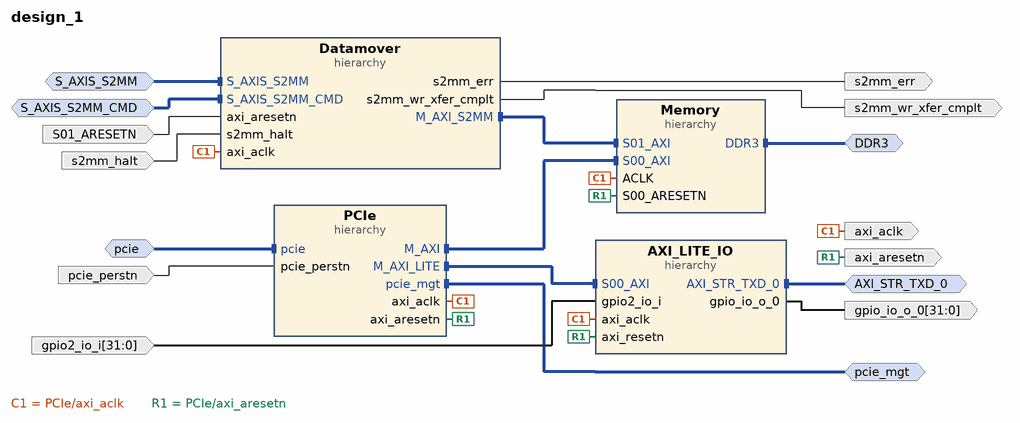
[diagram p0: block diagram of the top level]
# Vivado block design design_1, xc7a200tfbg484-2, Vivado 2020.1
create_bd_design design_1

create_bd_intf_port -mode Slave -vlnv xilinx.com:interface:diff_clock_rtl:1.0 pcie
create_bd_intf_port -mode Master -vlnv xilinx.com:interface:pcie_7x_mgt_rtl:1.0 pcie_mgt
create_bd_intf_port -mode Master -vlnv xilinx.com:interface:ddrx_rtl:1.0 DDR3
create_bd_intf_port -mode Slave -vlnv xilinx.com:interface:axis_rtl:1.0 S_AXIS_S2MM_CMD
set_property -dict [list \
  CONFIG.TDATA_NUM_BYTES 9 \
  CONFIG.TDEST_WIDTH 0 \
  CONFIG.TID_WIDTH 0 \
  CONFIG.TUSER_WIDTH 0 \
  CONFIG.HAS_TREADY 1 \
  CONFIG.HAS_TSTRB 0 \
  CONFIG.HAS_TKEEP 0 \
  CONFIG.HAS_TLAST 0 \
  CONFIG.FREQ_HZ 125000000 \
  CONFIG.LAYERED_METADATA undef \
] [get_bd_intf_ports S_AXIS_S2MM_CMD]
create_bd_intf_port -mode Master -vlnv xilinx.com:interface:axis_rtl:1.0 AXI_STR_TXD_0
set_property -dict {CONFIG.FREQ_HZ 125000000} [get_bd_intf_ports AXI_STR_TXD_0]
create_bd_intf_port -mode Slave -vlnv xilinx.com:interface:axis_rtl:1.0 S_AXIS_S2MM
set_property -dict [list \
  CONFIG.TDATA_NUM_BYTES 16 \
  CONFIG.TDEST_WIDTH 0 \
  CONFIG.TID_WIDTH 0 \
  CONFIG.TUSER_WIDTH 0 \
  CONFIG.HAS_TREADY 1 \
  CONFIG.HAS_TSTRB 0 \
  CONFIG.HAS_TKEEP 1 \
  CONFIG.HAS_TLAST 1 \
  CONFIG.FREQ_HZ 125000000 \
  CONFIG.LAYERED_METADATA undef \
] [get_bd_intf_ports S_AXIS_S2MM]
create_bd_port -dir I -type rst pcie_perstn
create_bd_port -dir O s2mm_err
create_bd_port -dir O s2mm_wr_xfer_cmplt
create_bd_port -dir I -from 31 -to 0 gpio2_io_i
create_bd_port -dir O axi_aresetn
create_bd_port -dir I -type rst S01_ARESETN
create_bd_port -dir I s2mm_halt
create_bd_port -dir O -type clk axi_aclk
create_bd_port -dir O -from 31 -to 0 gpio_io_o_0

create_bd_cell -type hier Memory
create_bd_cell -type hier Datamover
create_bd_cell -type hier AXI_LITE_IO
create_bd_cell -type hier PCIe

# ---- hierarchy /Memory ----
current_bd_instance /Memory
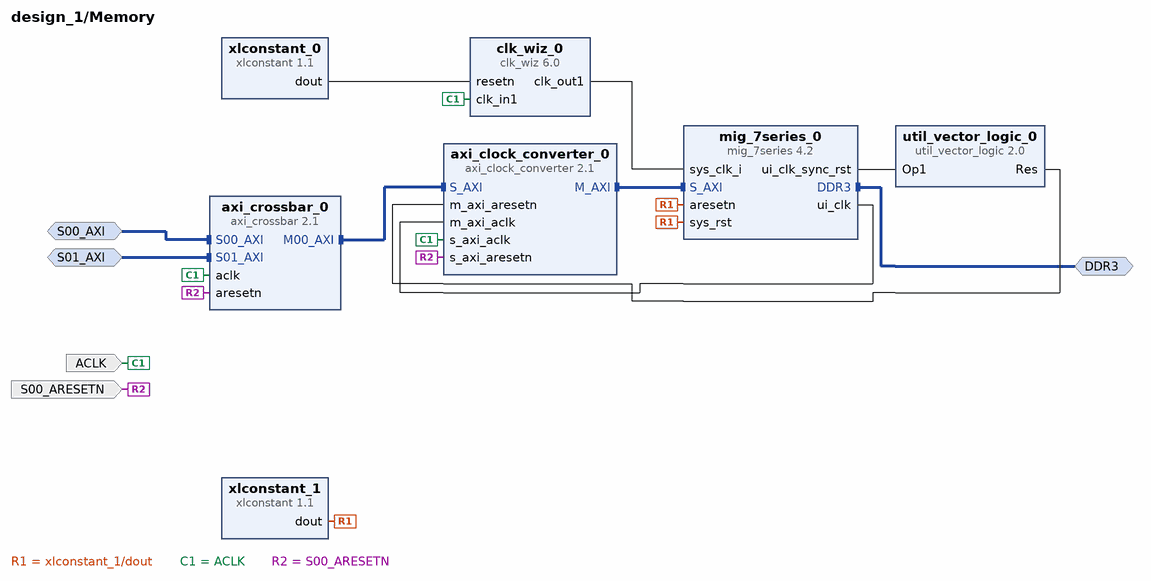
[diagram p1: block diagram inside /Memory]
create_bd_intf_pin -mode Master -vlnv xilinx.com:interface:ddrx_rtl:1.0 DDR3
create_bd_intf_pin -mode Slave -vlnv xilinx.com:interface:aximm_rtl:1.0 S00_AXI
create_bd_intf_pin -mode Slave -vlnv xilinx.com:interface:aximm_rtl:1.0 S01_AXI
create_bd_pin -dir I -type clk ACLK
create_bd_pin -dir I -type rst S00_ARESETN

create_bd_cell -type ip -vlnv xilinx.com:ip:axi_clock_converter:2.1 axi_clock_converter_0
create_bd_cell -type ip -vlnv xilinx.com:ip:axi_crossbar:2.1 axi_crossbar_0
set_property -dict [list \
  CONFIG.ADDR_WIDTH 32 \
  CONFIG.M00_A01_BASE_ADDR 0xffffffffffffffff \
  CONFIG.M00_A02_BASE_ADDR 0xffffffffffffffff \
  CONFIG.M00_A03_BASE_ADDR 0xffffffffffffffff \
  CONFIG.M00_A04_BASE_ADDR 0xffffffffffffffff \
  CONFIG.M00_A05_BASE_ADDR 0xffffffffffffffff \
  CONFIG.M00_A06_BASE_ADDR 0xffffffffffffffff \
  CONFIG.M00_A07_BASE_ADDR 0xffffffffffffffff \
  CONFIG.M00_A08_BASE_ADDR 0xffffffffffffffff \
  CONFIG.M00_A09_BASE_ADDR 0xffffffffffffffff \
  CONFIG.M00_A10_BASE_ADDR 0xffffffffffffffff \
  CONFIG.M00_A11_BASE_ADDR 0xffffffffffffffff \
  CONFIG.M00_A12_BASE_ADDR 0xffffffffffffffff \
  CONFIG.M00_A13_BASE_ADDR 0xffffffffffffffff \
  CONFIG.M00_A14_BASE_ADDR 0xffffffffffffffff \
  CONFIG.M00_A15_BASE_ADDR 0xffffffffffffffff \
  CONFIG.M01_A00_ADDR_WIDTH 0 \
  CONFIG.M01_A00_BASE_ADDR 0xffffffffffffffff \
  CONFIG.M01_A01_BASE_ADDR 0xffffffffffffffff \
  CONFIG.M01_A02_BASE_ADDR 0xffffffffffffffff \
  CONFIG.M01_A03_BASE_ADDR 0xffffffffffffffff \
  CONFIG.M01_A04_BASE_ADDR 0xffffffffffffffff \
  CONFIG.M01_A05_BASE_ADDR 0xffffffffffffffff \
  CONFIG.M01_A06_BASE_ADDR 0xffffffffffffffff \
  CONFIG.M01_A07_BASE_ADDR 0xffffffffffffffff \
  CONFIG.M01_A08_BASE_ADDR 0xffffffffffffffff \
  CONFIG.M01_A09_BASE_ADDR 0xffffffffffffffff \
  CONFIG.M01_A10_BASE_ADDR 0xffffffffffffffff \
  CONFIG.M01_A11_BASE_ADDR 0xffffffffffffffff \
  CONFIG.M01_A12_BASE_ADDR 0xffffffffffffffff \
  CONFIG.M01_A13_BASE_ADDR 0xffffffffffffffff \
  CONFIG.M01_A14_BASE_ADDR 0xffffffffffffffff \
  CONFIG.M01_A15_BASE_ADDR 0xffffffffffffffff \
  CONFIG.M02_A00_ADDR_WIDTH 0 \
  CONFIG.M02_A00_BASE_ADDR 0xffffffffffffffff \
  CONFIG.M02_A01_BASE_ADDR 0xffffffffffffffff \
  CONFIG.M02_A02_BASE_ADDR 0xffffffffffffffff \
  CONFIG.M02_A03_BASE_ADDR 0xffffffffffffffff \
  CONFIG.M02_A04_BASE_ADDR 0xffffffffffffffff \
  CONFIG.M02_A05_BASE_ADDR 0xffffffffffffffff \
  CONFIG.M02_A06_BASE_ADDR 0xffffffffffffffff \
  CONFIG.M02_A07_BASE_ADDR 0xffffffffffffffff \
  CONFIG.M02_A08_BASE_ADDR 0xffffffffffffffff \
  CONFIG.M02_A09_BASE_ADDR 0xffffffffffffffff \
  CONFIG.M02_A10_BASE_ADDR 0xffffffffffffffff \
  CONFIG.M02_A11_BASE_ADDR 0xffffffffffffffff \
  CONFIG.M02_A12_BASE_ADDR 0xffffffffffffffff \
  CONFIG.M02_A13_BASE_ADDR 0xffffffffffffffff \
  CONFIG.M02_A14_BASE_ADDR 0xffffffffffffffff \
  CONFIG.M02_A15_BASE_ADDR 0xffffffffffffffff \
  CONFIG.M03_A00_ADDR_WIDTH 0 \
  CONFIG.M03_A00_BASE_ADDR 0xffffffffffffffff \
  CONFIG.M03_A01_BASE_ADDR 0xffffffffffffffff \
  CONFIG.M03_A02_BASE_ADDR 0xffffffffffffffff \
  CONFIG.M03_A03_BASE_ADDR 0xffffffffffffffff \
  CONFIG.M03_A04_BASE_ADDR 0xffffffffffffffff \
  CONFIG.M03_A05_BASE_ADDR 0xffffffffffffffff \
  CONFIG.M03_A06_BASE_ADDR 0xffffffffffffffff \
  CONFIG.M03_A07_BASE_ADDR 0xffffffffffffffff \
  CONFIG.M03_A08_BASE_ADDR 0xffffffffffffffff \
  CONFIG.M03_A09_BASE_ADDR 0xffffffffffffffff \
  CONFIG.M03_A10_BASE_ADDR 0xffffffffffffffff \
  CONFIG.M03_A11_BASE_ADDR 0xffffffffffffffff \
  CONFIG.M03_A12_BASE_ADDR 0xffffffffffffffff \
  CONFIG.M03_A13_BASE_ADDR 0xffffffffffffffff \
  CONFIG.M03_A14_BASE_ADDR 0xffffffffffffffff \
  CONFIG.M03_A15_BASE_ADDR 0xffffffffffffffff \
  CONFIG.M04_A00_ADDR_WIDTH 0 \
  CONFIG.M04_A00_BASE_ADDR 0xffffffffffffffff \
  CONFIG.M04_A01_BASE_ADDR 0xffffffffffffffff \
  CONFIG.M04_A02_BASE_ADDR 0xffffffffffffffff \
  CONFIG.M04_A03_BASE_ADDR 0xffffffffffffffff \
  CONFIG.M04_A04_BASE_ADDR 0xffffffffffffffff \
  CONFIG.M04_A05_BASE_ADDR 0xffffffffffffffff \
  CONFIG.M04_A06_BASE_ADDR 0xffffffffffffffff \
  CONFIG.M04_A07_BASE_ADDR 0xffffffffffffffff \
  CONFIG.M04_A08_BASE_ADDR 0xffffffffffffffff \
  CONFIG.M04_A09_BASE_ADDR 0xffffffffffffffff \
  CONFIG.M04_A10_BASE_ADDR 0xffffffffffffffff \
  CONFIG.M04_A11_BASE_ADDR 0xffffffffffffffff \
  CONFIG.M04_A12_BASE_ADDR 0xffffffffffffffff \
  CONFIG.M04_A13_BASE_ADDR 0xffffffffffffffff \
  CONFIG.M04_A14_BASE_ADDR 0xffffffffffffffff \
  CONFIG.M04_A15_BASE_ADDR 0xffffffffffffffff \
  CONFIG.M05_A00_ADDR_WIDTH 0 \
  CONFIG.M05_A00_BASE_ADDR 0xffffffffffffffff \
  CONFIG.M05_A01_BASE_ADDR 0xffffffffffffffff \
  CONFIG.M05_A02_BASE_ADDR 0xffffffffffffffff \
  CONFIG.M05_A03_BASE_ADDR 0xffffffffffffffff \
  CONFIG.M05_A04_BASE_ADDR 0xffffffffffffffff \
  CONFIG.M05_A05_BASE_ADDR 0xffffffffffffffff \
  CONFIG.M05_A06_BASE_ADDR 0xffffffffffffffff \
  CONFIG.M05_A07_BASE_ADDR 0xffffffffffffffff \
  CONFIG.M05_A08_BASE_ADDR 0xffffffffffffffff \
  CONFIG.M05_A09_BASE_ADDR 0xffffffffffffffff \
  CONFIG.M05_A10_BASE_ADDR 0xffffffffffffffff \
  CONFIG.M05_A11_BASE_ADDR 0xffffffffffffffff \
  CONFIG.M05_A12_BASE_ADDR 0xffffffffffffffff \
  CONFIG.M05_A13_BASE_ADDR 0xffffffffffffffff \
  CONFIG.M05_A14_BASE_ADDR 0xffffffffffffffff \
  CONFIG.M05_A15_BASE_ADDR 0xffffffffffffffff \
  CONFIG.M06_A00_ADDR_WIDTH 0 \
  CONFIG.M06_A00_BASE_ADDR 0xffffffffffffffff \
  CONFIG.M06_A01_BASE_ADDR 0xffffffffffffffff \
  CONFIG.M06_A02_BASE_ADDR 0xffffffffffffffff \
  CONFIG.M06_A03_BASE_ADDR 0xffffffffffffffff \
  CONFIG.M06_A04_BASE_ADDR 0xffffffffffffffff \
  CONFIG.M06_A05_BASE_ADDR 0xffffffffffffffff \
  CONFIG.M06_A06_BASE_ADDR 0xffffffffffffffff \
  CONFIG.M06_A07_BASE_ADDR 0xffffffffffffffff \
  CONFIG.M06_A08_BASE_ADDR 0xffffffffffffffff \
  CONFIG.M06_A09_BASE_ADDR 0xffffffffffffffff \
  CONFIG.M06_A10_BASE_ADDR 0xffffffffffffffff \
  CONFIG.M06_A11_BASE_ADDR 0xffffffffffffffff \
  CONFIG.M06_A12_BASE_ADDR 0xffffffffffffffff \
  CONFIG.M06_A13_BASE_ADDR 0xffffffffffffffff \
  CONFIG.M06_A14_BASE_ADDR 0xffffffffffffffff \
  CONFIG.M06_A15_BASE_ADDR 0xffffffffffffffff \
  CONFIG.M07_A00_ADDR_WIDTH 0 \
  CONFIG.M07_A00_BASE_ADDR 0xffffffffffffffff \
  CONFIG.M07_A01_BASE_ADDR 0xffffffffffffffff \
  CONFIG.M07_A02_BASE_ADDR 0xffffffffffffffff \
  CONFIG.M07_A03_BASE_ADDR 0xffffffffffffffff \
  CONFIG.M07_A04_BASE_ADDR 0xffffffffffffffff \
  CONFIG.M07_A05_BASE_ADDR 0xffffffffffffffff \
  CONFIG.M07_A06_BASE_ADDR 0xffffffffffffffff \
  CONFIG.M07_A07_BASE_ADDR 0xffffffffffffffff \
  CONFIG.M07_A08_BASE_ADDR 0xffffffffffffffff \
  CONFIG.M07_A09_BASE_ADDR 0xffffffffffffffff \
  CONFIG.M07_A10_BASE_ADDR 0xffffffffffffffff \
  CONFIG.M07_A11_BASE_ADDR 0xffffffffffffffff \
  CONFIG.M07_A12_BASE_ADDR 0xffffffffffffffff \
  CONFIG.M07_A13_BASE_ADDR 0xffffffffffffffff \
  CONFIG.M07_A14_BASE_ADDR 0xffffffffffffffff \
  CONFIG.M07_A15_BASE_ADDR 0xffffffffffffffff \
  CONFIG.M08_A00_ADDR_WIDTH 0 \
  CONFIG.M08_A00_BASE_ADDR 0xffffffffffffffff \
  CONFIG.M08_A01_BASE_ADDR 0xffffffffffffffff \
  CONFIG.M08_A02_BASE_ADDR 0xffffffffffffffff \
  CONFIG.M08_A03_BASE_ADDR 0xffffffffffffffff \
  CONFIG.M08_A04_BASE_ADDR 0xffffffffffffffff \
  CONFIG.M08_A05_BASE_ADDR 0xffffffffffffffff \
  CONFIG.M08_A06_BASE_ADDR 0xffffffffffffffff \
  CONFIG.M08_A07_BASE_ADDR 0xffffffffffffffff \
  CONFIG.M08_A08_BASE_ADDR 0xffffffffffffffff \
  CONFIG.M08_A09_BASE_ADDR 0xffffffffffffffff \
  CONFIG.M08_A10_BASE_ADDR 0xffffffffffffffff \
  CONFIG.M08_A11_BASE_ADDR 0xffffffffffffffff \
  CONFIG.M08_A12_BASE_ADDR 0xffffffffffffffff \
  CONFIG.M08_A13_BASE_ADDR 0xffffffffffffffff \
  CONFIG.M08_A14_BASE_ADDR 0xffffffffffffffff \
  CONFIG.M08_A15_BASE_ADDR 0xffffffffffffffff \
  CONFIG.M09_A00_ADDR_WIDTH 0 \
  CONFIG.M09_A00_BASE_ADDR 0xffffffffffffffff \
  CONFIG.M09_A01_BASE_ADDR 0xffffffffffffffff \
  CONFIG.M09_A02_BASE_ADDR 0xffffffffffffffff \
  CONFIG.M09_A03_BASE_ADDR 0xffffffffffffffff \
  CONFIG.M09_A04_BASE_ADDR 0xffffffffffffffff \
  CONFIG.M09_A05_BASE_ADDR 0xffffffffffffffff \
  CONFIG.M09_A06_BASE_ADDR 0xffffffffffffffff \
  CONFIG.M09_A07_BASE_ADDR 0xffffffffffffffff \
  CONFIG.M09_A08_BASE_ADDR 0xffffffffffffffff \
  CONFIG.M09_A09_BASE_ADDR 0xffffffffffffffff \
  CONFIG.M09_A10_BASE_ADDR 0xffffffffffffffff \
  CONFIG.M09_A11_BASE_ADDR 0xffffffffffffffff \
  CONFIG.M09_A12_BASE_ADDR 0xffffffffffffffff \
  CONFIG.M09_A13_BASE_ADDR 0xffffffffffffffff \
  CONFIG.M09_A14_BASE_ADDR 0xffffffffffffffff \
  CONFIG.M09_A15_BASE_ADDR 0xffffffffffffffff \
  CONFIG.M10_A00_ADDR_WIDTH 0 \
  CONFIG.M10_A00_BASE_ADDR 0xffffffffffffffff \
  CONFIG.M10_A01_BASE_ADDR 0xffffffffffffffff \
  CONFIG.M10_A02_BASE_ADDR 0xffffffffffffffff \
  CONFIG.M10_A03_BASE_ADDR 0xffffffffffffffff \
  CONFIG.M10_A04_BASE_ADDR 0xffffffffffffffff \
  CONFIG.M10_A05_BASE_ADDR 0xffffffffffffffff \
  CONFIG.M10_A06_BASE_ADDR 0xffffffffffffffff \
  CONFIG.M10_A07_BASE_ADDR 0xffffffffffffffff \
  CONFIG.M10_A08_BASE_ADDR 0xffffffffffffffff \
  CONFIG.M10_A09_BASE_ADDR 0xffffffffffffffff \
  CONFIG.M10_A10_BASE_ADDR 0xffffffffffffffff \
  CONFIG.M10_A11_BASE_ADDR 0xffffffffffffffff \
  CONFIG.M10_A12_BASE_ADDR 0xffffffffffffffff \
  CONFIG.M10_A13_BASE_ADDR 0xffffffffffffffff \
  CONFIG.M10_A14_BASE_ADDR 0xffffffffffffffff \
  CONFIG.M10_A15_BASE_ADDR 0xffffffffffffffff \
  CONFIG.M11_A00_ADDR_WIDTH 0 \
  CONFIG.M11_A00_BASE_ADDR 0xffffffffffffffff \
  CONFIG.M11_A01_BASE_ADDR 0xffffffffffffffff \
  CONFIG.M11_A02_BASE_ADDR 0xffffffffffffffff \
  CONFIG.M11_A03_BASE_ADDR 0xffffffffffffffff \
  CONFIG.M11_A04_BASE_ADDR 0xffffffffffffffff \
  CONFIG.M11_A05_BASE_ADDR 0xffffffffffffffff \
  CONFIG.M11_A06_BASE_ADDR 0xffffffffffffffff \
  CONFIG.M11_A07_BASE_ADDR 0xffffffffffffffff \
  CONFIG.M11_A08_BASE_ADDR 0xffffffffffffffff \
  CONFIG.M11_A09_BASE_ADDR 0xffffffffffffffff \
  CONFIG.M11_A10_BASE_ADDR 0xffffffffffffffff \
  CONFIG.M11_A11_BASE_ADDR 0xffffffffffffffff \
  CONFIG.M11_A12_BASE_ADDR 0xffffffffffffffff \
  CONFIG.M11_A13_BASE_ADDR 0xffffffffffffffff \
  CONFIG.M11_A14_BASE_ADDR 0xffffffffffffffff \
  CONFIG.M11_A15_BASE_ADDR 0xffffffffffffffff \
  CONFIG.M12_A00_ADDR_WIDTH 0 \
  CONFIG.M12_A00_BASE_ADDR 0xffffffffffffffff \
  CONFIG.M12_A01_BASE_ADDR 0xffffffffffffffff \
  CONFIG.M12_A02_BASE_ADDR 0xffffffffffffffff \
  CONFIG.M12_A03_BASE_ADDR 0xffffffffffffffff \
  CONFIG.M12_A04_BASE_ADDR 0xffffffffffffffff \
  CONFIG.M12_A05_BASE_ADDR 0xffffffffffffffff \
  CONFIG.M12_A06_BASE_ADDR 0xffffffffffffffff \
  CONFIG.M12_A07_BASE_ADDR 0xffffffffffffffff \
  CONFIG.M12_A08_BASE_ADDR 0xffffffffffffffff \
  CONFIG.M12_A09_BASE_ADDR 0xffffffffffffffff \
  CONFIG.M12_A10_BASE_ADDR 0xffffffffffffffff \
  CONFIG.M12_A11_BASE_ADDR 0xffffffffffffffff \
  CONFIG.M12_A12_BASE_ADDR 0xffffffffffffffff \
  CONFIG.M12_A13_BASE_ADDR 0xffffffffffffffff \
  CONFIG.M12_A14_BASE_ADDR 0xffffffffffffffff \
  CONFIG.M12_A15_BASE_ADDR 0xffffffffffffffff \
  CONFIG.M13_A00_ADDR_WIDTH 0 \
  CONFIG.M13_A00_BASE_ADDR 0xffffffffffffffff \
  CONFIG.M13_A01_BASE_ADDR 0xffffffffffffffff \
  CONFIG.M13_A02_BASE_ADDR 0xffffffffffffffff \
  CONFIG.M13_A03_BASE_ADDR 0xffffffffffffffff \
  CONFIG.M13_A04_BASE_ADDR 0xffffffffffffffff \
  CONFIG.M13_A05_BASE_ADDR 0xffffffffffffffff \
  CONFIG.M13_A06_BASE_ADDR 0xffffffffffffffff \
  CONFIG.M13_A07_BASE_ADDR 0xffffffffffffffff \
  CONFIG.M13_A08_BASE_ADDR 0xffffffffffffffff \
  CONFIG.M13_A09_BASE_ADDR 0xffffffffffffffff \
  CONFIG.M13_A10_BASE_ADDR 0xffffffffffffffff \
  CONFIG.M13_A11_BASE_ADDR 0xffffffffffffffff \
  CONFIG.M13_A12_BASE_ADDR 0xffffffffffffffff \
  CONFIG.M13_A13_BASE_ADDR 0xffffffffffffffff \
  CONFIG.M13_A14_BASE_ADDR 0xffffffffffffffff \
  CONFIG.M13_A15_BASE_ADDR 0xffffffffffffffff \
  CONFIG.M14_A00_ADDR_WIDTH 0 \
  CONFIG.M14_A00_BASE_ADDR 0xffffffffffffffff \
  CONFIG.M14_A01_BASE_ADDR 0xffffffffffffffff \
  CONFIG.M14_A02_BASE_ADDR 0xffffffffffffffff \
  CONFIG.M14_A03_BASE_ADDR 0xffffffffffffffff \
  CONFIG.M14_A04_BASE_ADDR 0xffffffffffffffff \
  CONFIG.M14_A05_BASE_ADDR 0xffffffffffffffff \
  CONFIG.M14_A06_BASE_ADDR 0xffffffffffffffff \
  CONFIG.M14_A07_BASE_ADDR 0xffffffffffffffff \
  CONFIG.M14_A08_BASE_ADDR 0xffffffffffffffff \
  CONFIG.M14_A09_BASE_ADDR 0xffffffffffffffff \
  CONFIG.M14_A10_BASE_ADDR 0xffffffffffffffff \
  CONFIG.M14_A11_BASE_ADDR 0xffffffffffffffff \
  CONFIG.M14_A12_BASE_ADDR 0xffffffffffffffff \
  CONFIG.M14_A13_BASE_ADDR 0xffffffffffffffff \
  CONFIG.M14_A14_BASE_ADDR 0xffffffffffffffff \
  CONFIG.M14_A15_BASE_ADDR 0xffffffffffffffff \
  CONFIG.M15_A00_ADDR_WIDTH 0 \
  CONFIG.M15_A00_BASE_ADDR 0xffffffffffffffff \
  CONFIG.M15_A01_BASE_ADDR 0xffffffffffffffff \
  CONFIG.M15_A02_BASE_ADDR 0xffffffffffffffff \
  CONFIG.M15_A03_BASE_ADDR 0xffffffffffffffff \
  CONFIG.M15_A04_BASE_ADDR 0xffffffffffffffff \
  CONFIG.M15_A05_BASE_ADDR 0xffffffffffffffff \
  CONFIG.M15_A06_BASE_ADDR 0xffffffffffffffff \
  CONFIG.M15_A07_BASE_ADDR 0xffffffffffffffff \
  CONFIG.M15_A08_BASE_ADDR 0xffffffffffffffff \
  CONFIG.M15_A09_BASE_ADDR 0xffffffffffffffff \
  CONFIG.M15_A10_BASE_ADDR 0xffffffffffffffff \
  CONFIG.M15_A11_BASE_ADDR 0xffffffffffffffff \
  CONFIG.M15_A12_BASE_ADDR 0xffffffffffffffff \
  CONFIG.M15_A13_BASE_ADDR 0xffffffffffffffff \
  CONFIG.M15_A14_BASE_ADDR 0xffffffffffffffff \
  CONFIG.M15_A15_BASE_ADDR 0xffffffffffffffff \
  CONFIG.NUM_MI 1 \
  CONFIG.NUM_SI 2 \
] [get_bd_cells axi_crossbar_0]
create_bd_cell -type ip -vlnv xilinx.com:ip:clk_wiz:6.0 clk_wiz_0
set_property -dict [list \
  CONFIG.CLKIN1_JITTER_PS 80.0 \
  CONFIG.CLKIN2_JITTER_PS 100.0 \
  CONFIG.CLKOUT1_DRIVES BUFG \
  CONFIG.CLKOUT1_JITTER 109.241 \
  CONFIG.CLKOUT1_PHASE_ERROR 96.948 \
  CONFIG.CLKOUT1_REQUESTED_OUT_FREQ 200 \
  CONFIG.CLKOUT2_DRIVES BUFG \
  CONFIG.CLKOUT3_DRIVES BUFG \
  CONFIG.CLKOUT4_DRIVES BUFG \
  CONFIG.CLKOUT5_DRIVES BUFG \
  CONFIG.CLKOUT6_DRIVES BUFG \
  CONFIG.CLKOUT7_DRIVES BUFG \
  CONFIG.MMCM_BANDWIDTH OPTIMIZED \
  CONFIG.MMCM_CLKFBOUT_MULT_F 8 \
  CONFIG.MMCM_CLKIN1_PERIOD 8.000 \
  CONFIG.MMCM_CLKIN2_PERIOD 10.0 \
  CONFIG.MMCM_CLKOUT0_DIVIDE_F 5 \
  CONFIG.MMCM_COMPENSATION ZHOLD \
  CONFIG.PLL_CLKIN_PERIOD 8.000 \
  CONFIG.PRIMITIVE PLL \
  CONFIG.PRIM_IN_FREQ 125.000 \
  CONFIG.PRIM_SOURCE No_buffer \
  CONFIG.RESET_PORT resetn \
  CONFIG.RESET_TYPE ACTIVE_LOW \
  CONFIG.SECONDARY_SOURCE Single_ended_clock_capable_pin \
  CONFIG.USE_INCLK_SWITCHOVER false \
] [get_bd_cells clk_wiz_0]
create_bd_cell -type ip -vlnv xilinx.com:ip:mig_7series:4.2 mig_7series_0
set_property -dict [list \
  CONFIG.BOARD_MIG_PARAM Custom \
  CONFIG.MIG_DONT_TOUCH_PARAM Custom \
  CONFIG.RESET_BOARD_INTERFACE Custom \
  CONFIG.XML_INPUT_FILE mig_b.prj \
] [get_bd_cells mig_7series_0]
create_bd_cell -type ip -vlnv xilinx.com:ip:util_vector_logic:2.0 util_vector_logic_0
set_property -dict {CONFIG.C_OPERATION not CONFIG.C_SIZE 1} [get_bd_cells util_vector_logic_0]
create_bd_cell -type ip -vlnv xilinx.com:ip:xlconstant:1.1 xlconstant_0
create_bd_cell -type ip -vlnv xilinx.com:ip:xlconstant:1.1 xlconstant_1

# ---- hierarchy /Datamover ----
current_bd_instance /Datamover
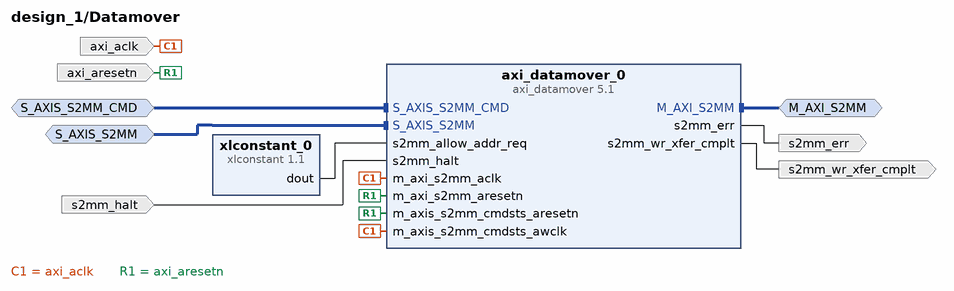
[diagram p2: block diagram inside /Datamover]
create_bd_intf_pin -mode Slave -vlnv xilinx.com:interface:axis_rtl:1.0 S_AXIS_S2MM_CMD
create_bd_intf_pin -mode Master -vlnv xilinx.com:interface:aximm_rtl:1.0 M_AXI_S2MM
create_bd_intf_pin -mode Slave -vlnv xilinx.com:interface:axis_rtl:1.0 S_AXIS_S2MM
create_bd_pin -dir I -type clk axi_aclk
create_bd_pin -dir I -type rst axi_aresetn
create_bd_pin -dir O s2mm_err
create_bd_pin -dir O s2mm_wr_xfer_cmplt
create_bd_pin -dir I s2mm_halt

create_bd_cell -type ip -vlnv xilinx.com:ip:axi_datamover:5.1 axi_datamover_0
set_property -dict [list \
  CONFIG.c_dummy 1 \
  CONFIG.c_enable_mm2s 0 \
  CONFIG.c_enable_s2mm_adv_sig 1 \
  CONFIG.c_m_axi_s2mm_data_width 256 \
  CONFIG.c_m_axi_s2mm_id_width 0 \
  CONFIG.c_s2mm_burst_size 128 \
  CONFIG.c_s_axis_s2mm_tdata_width 128 \
] [get_bd_cells axi_datamover_0]
create_bd_cell -type ip -vlnv xilinx.com:ip:xlconstant:1.1 xlconstant_0

# ---- hierarchy /AXI_LITE_IO ----
current_bd_instance /AXI_LITE_IO
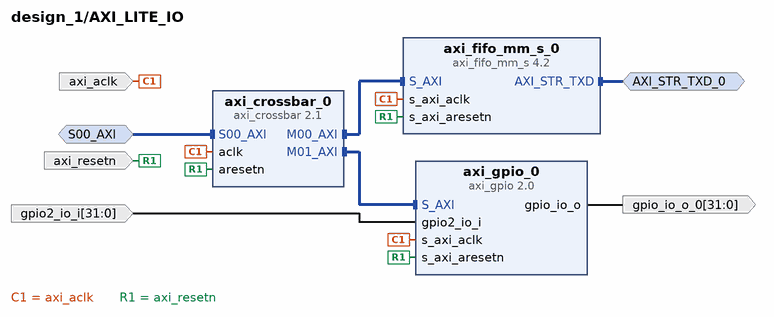
[diagram p3: block diagram inside /AXI_LITE_IO]
create_bd_intf_pin -mode Slave -vlnv xilinx.com:interface:aximm_rtl:1.0 S00_AXI
create_bd_intf_pin -mode Master -vlnv xilinx.com:interface:axis_rtl:1.0 AXI_STR_TXD_0
create_bd_pin -dir I -from 31 -to 0 gpio2_io_i
create_bd_pin -dir I -type clk axi_aclk
create_bd_pin -dir I -type rst axi_resetn
create_bd_pin -dir O -from 31 -to 0 gpio_io_o_0

create_bd_cell -type ip -vlnv xilinx.com:ip:axi_crossbar:2.1 axi_crossbar_0
set_property -dict [list \
  CONFIG.M00_A01_BASE_ADDR 0xffffffffffffffff \
  CONFIG.M00_A02_BASE_ADDR 0xffffffffffffffff \
  CONFIG.M00_A03_BASE_ADDR 0xffffffffffffffff \
  CONFIG.M00_A04_BASE_ADDR 0xffffffffffffffff \
  CONFIG.M00_A05_BASE_ADDR 0xffffffffffffffff \
  CONFIG.M00_A06_BASE_ADDR 0xffffffffffffffff \
  CONFIG.M00_A07_BASE_ADDR 0xffffffffffffffff \
  CONFIG.M00_A08_BASE_ADDR 0xffffffffffffffff \
  CONFIG.M00_A09_BASE_ADDR 0xffffffffffffffff \
  CONFIG.M00_A10_BASE_ADDR 0xffffffffffffffff \
  CONFIG.M00_A11_BASE_ADDR 0xffffffffffffffff \
  CONFIG.M00_A12_BASE_ADDR 0xffffffffffffffff \
  CONFIG.M00_A13_BASE_ADDR 0xffffffffffffffff \
  CONFIG.M00_A14_BASE_ADDR 0xffffffffffffffff \
  CONFIG.M00_A15_BASE_ADDR 0xffffffffffffffff \
  CONFIG.M01_A01_BASE_ADDR 0xffffffffffffffff \
  CONFIG.M01_A02_BASE_ADDR 0xffffffffffffffff \
  CONFIG.M01_A03_BASE_ADDR 0xffffffffffffffff \
  CONFIG.M01_A04_BASE_ADDR 0xffffffffffffffff \
  CONFIG.M01_A05_BASE_ADDR 0xffffffffffffffff \
  CONFIG.M01_A06_BASE_ADDR 0xffffffffffffffff \
  CONFIG.M01_A07_BASE_ADDR 0xffffffffffffffff \
  CONFIG.M01_A08_BASE_ADDR 0xffffffffffffffff \
  CONFIG.M01_A09_BASE_ADDR 0xffffffffffffffff \
  CONFIG.M01_A10_BASE_ADDR 0xffffffffffffffff \
  CONFIG.M01_A11_BASE_ADDR 0xffffffffffffffff \
  CONFIG.M01_A12_BASE_ADDR 0xffffffffffffffff \
  CONFIG.M01_A13_BASE_ADDR 0xffffffffffffffff \
  CONFIG.M01_A14_BASE_ADDR 0xffffffffffffffff \
  CONFIG.M01_A15_BASE_ADDR 0xffffffffffffffff \
  CONFIG.M02_A00_ADDR_WIDTH 0 \
  CONFIG.M02_A00_BASE_ADDR 0xffffffffffffffff \
  CONFIG.M02_A01_BASE_ADDR 0xffffffffffffffff \
  CONFIG.M02_A02_BASE_ADDR 0xffffffffffffffff \
  CONFIG.M02_A03_BASE_ADDR 0xffffffffffffffff \
  CONFIG.M02_A04_BASE_ADDR 0xffffffffffffffff \
  CONFIG.M02_A05_BASE_ADDR 0xffffffffffffffff \
  CONFIG.M02_A06_BASE_ADDR 0xffffffffffffffff \
  CONFIG.M02_A07_BASE_ADDR 0xffffffffffffffff \
  CONFIG.M02_A08_BASE_ADDR 0xffffffffffffffff \
  CONFIG.M02_A09_BASE_ADDR 0xffffffffffffffff \
  CONFIG.M02_A10_BASE_ADDR 0xffffffffffffffff \
  CONFIG.M02_A11_BASE_ADDR 0xffffffffffffffff \
  CONFIG.M02_A12_BASE_ADDR 0xffffffffffffffff \
  CONFIG.M02_A13_BASE_ADDR 0xffffffffffffffff \
  CONFIG.M02_A14_BASE_ADDR 0xffffffffffffffff \
  CONFIG.M02_A15_BASE_ADDR 0xffffffffffffffff \
  CONFIG.M02_READ_ISSUING 1 \
  CONFIG.M02_WRITE_ISSUING 1 \
  CONFIG.M03_A00_ADDR_WIDTH 0 \
  CONFIG.M03_A00_BASE_ADDR 0xffffffffffffffff \
  CONFIG.M03_A01_BASE_ADDR 0xffffffffffffffff \
  CONFIG.M03_A02_BASE_ADDR 0xffffffffffffffff \
  CONFIG.M03_A03_BASE_ADDR 0xffffffffffffffff \
  CONFIG.M03_A04_BASE_ADDR 0xffffffffffffffff \
  CONFIG.M03_A05_BASE_ADDR 0xffffffffffffffff \
  CONFIG.M03_A06_BASE_ADDR 0xffffffffffffffff \
  CONFIG.M03_A07_BASE_ADDR 0xffffffffffffffff \
  CONFIG.M03_A08_BASE_ADDR 0xffffffffffffffff \
  CONFIG.M03_A09_BASE_ADDR 0xffffffffffffffff \
  CONFIG.M03_A10_BASE_ADDR 0xffffffffffffffff \
  CONFIG.M03_A11_BASE_ADDR 0xffffffffffffffff \
  CONFIG.M03_A12_BASE_ADDR 0xffffffffffffffff \
  CONFIG.M03_A13_BASE_ADDR 0xffffffffffffffff \
  CONFIG.M03_A14_BASE_ADDR 0xffffffffffffffff \
  CONFIG.M03_A15_BASE_ADDR 0xffffffffffffffff \
  CONFIG.M03_READ_ISSUING 1 \
  CONFIG.M03_WRITE_ISSUING 1 \
  CONFIG.M04_A00_ADDR_WIDTH 0 \
  CONFIG.M04_A00_BASE_ADDR 0xffffffffffffffff \
  CONFIG.M04_A01_BASE_ADDR 0xffffffffffffffff \
  CONFIG.M04_A02_BASE_ADDR 0xffffffffffffffff \
  CONFIG.M04_A03_BASE_ADDR 0xffffffffffffffff \
  CONFIG.M04_A04_BASE_ADDR 0xffffffffffffffff \
  CONFIG.M04_A05_BASE_ADDR 0xffffffffffffffff \
  CONFIG.M04_A06_BASE_ADDR 0xffffffffffffffff \
  CONFIG.M04_A07_BASE_ADDR 0xffffffffffffffff \
  CONFIG.M04_A08_BASE_ADDR 0xffffffffffffffff \
  CONFIG.M04_A09_BASE_ADDR 0xffffffffffffffff \
  CONFIG.M04_A10_BASE_ADDR 0xffffffffffffffff \
  CONFIG.M04_A11_BASE_ADDR 0xffffffffffffffff \
  CONFIG.M04_A12_BASE_ADDR 0xffffffffffffffff \
  CONFIG.M04_A13_BASE_ADDR 0xffffffffffffffff \
  CONFIG.M04_A14_BASE_ADDR 0xffffffffffffffff \
  CONFIG.M04_A15_BASE_ADDR 0xffffffffffffffff \
  CONFIG.M04_READ_ISSUING 1 \
  CONFIG.M04_WRITE_ISSUING 1 \
  CONFIG.M05_A00_ADDR_WIDTH 0 \
  CONFIG.M05_A00_BASE_ADDR 0xffffffffffffffff \
  CONFIG.M05_A01_BASE_ADDR 0xffffffffffffffff \
  CONFIG.M05_A02_BASE_ADDR 0xffffffffffffffff \
  CONFIG.M05_A03_BASE_ADDR 0xffffffffffffffff \
  CONFIG.M05_A04_BASE_ADDR 0xffffffffffffffff \
  CONFIG.M05_A05_BASE_ADDR 0xffffffffffffffff \
  CONFIG.M05_A06_BASE_ADDR 0xffffffffffffffff \
  CONFIG.M05_A07_BASE_ADDR 0xffffffffffffffff \
  CONFIG.M05_A08_BASE_ADDR 0xffffffffffffffff \
  CONFIG.M05_A09_BASE_ADDR 0xffffffffffffffff \
  CONFIG.M05_A10_BASE_ADDR 0xffffffffffffffff \
  CONFIG.M05_A11_BASE_ADDR 0xffffffffffffffff \
  CONFIG.M05_A12_BASE_ADDR 0xffffffffffffffff \
  CONFIG.M05_A13_BASE_ADDR 0xffffffffffffffff \
  CONFIG.M05_A14_BASE_ADDR 0xffffffffffffffff \
  CONFIG.M05_A15_BASE_ADDR 0xffffffffffffffff \
  CONFIG.M05_READ_ISSUING 1 \
  CONFIG.M05_WRITE_ISSUING 1 \
  CONFIG.M06_A00_ADDR_WIDTH 0 \
  CONFIG.M06_A00_BASE_ADDR 0xffffffffffffffff \
  CONFIG.M06_A01_BASE_ADDR 0xffffffffffffffff \
  CONFIG.M06_A02_BASE_ADDR 0xffffffffffffffff \
  CONFIG.M06_A03_BASE_ADDR 0xffffffffffffffff \
  CONFIG.M06_A04_BASE_ADDR 0xffffffffffffffff \
  CONFIG.M06_A05_BASE_ADDR 0xffffffffffffffff \
  CONFIG.M06_A06_BASE_ADDR 0xffffffffffffffff \
  CONFIG.M06_A07_BASE_ADDR 0xffffffffffffffff \
  CONFIG.M06_A08_BASE_ADDR 0xffffffffffffffff \
  CONFIG.M06_A09_BASE_ADDR 0xffffffffffffffff \
  CONFIG.M06_A10_BASE_ADDR 0xffffffffffffffff \
  CONFIG.M06_A11_BASE_ADDR 0xffffffffffffffff \
  CONFIG.M06_A12_BASE_ADDR 0xffffffffffffffff \
  CONFIG.M06_A13_BASE_ADDR 0xffffffffffffffff \
  CONFIG.M06_A14_BASE_ADDR 0xffffffffffffffff \
  CONFIG.M06_A15_BASE_ADDR 0xffffffffffffffff \
  CONFIG.M06_READ_ISSUING 1 \
  CONFIG.M06_WRITE_ISSUING 1 \
  CONFIG.M07_A00_ADDR_WIDTH 0 \
  CONFIG.M07_A00_BASE_ADDR 0xffffffffffffffff \
  CONFIG.M07_A01_BASE_ADDR 0xffffffffffffffff \
  CONFIG.M07_A02_BASE_ADDR 0xffffffffffffffff \
  CONFIG.M07_A03_BASE_ADDR 0xffffffffffffffff \
  CONFIG.M07_A04_BASE_ADDR 0xffffffffffffffff \
  CONFIG.M07_A05_BASE_ADDR 0xffffffffffffffff \
  CONFIG.M07_A06_BASE_ADDR 0xffffffffffffffff \
  CONFIG.M07_A07_BASE_ADDR 0xffffffffffffffff \
  CONFIG.M07_A08_BASE_ADDR 0xffffffffffffffff \
  CONFIG.M07_A09_BASE_ADDR 0xffffffffffffffff \
  CONFIG.M07_A10_BASE_ADDR 0xffffffffffffffff \
  CONFIG.M07_A11_BASE_ADDR 0xffffffffffffffff \
  CONFIG.M07_A12_BASE_ADDR 0xffffffffffffffff \
  CONFIG.M07_A13_BASE_ADDR 0xffffffffffffffff \
  CONFIG.M07_A14_BASE_ADDR 0xffffffffffffffff \
  CONFIG.M07_A15_BASE_ADDR 0xffffffffffffffff \
  CONFIG.M07_READ_ISSUING 1 \
  CONFIG.M07_WRITE_ISSUING 1 \
  CONFIG.M08_A00_ADDR_WIDTH 0 \
  CONFIG.M08_A00_BASE_ADDR 0xffffffffffffffff \
  CONFIG.M08_A01_BASE_ADDR 0xffffffffffffffff \
  CONFIG.M08_A02_BASE_ADDR 0xffffffffffffffff \
  CONFIG.M08_A03_BASE_ADDR 0xffffffffffffffff \
  CONFIG.M08_A04_BASE_ADDR 0xffffffffffffffff \
  CONFIG.M08_A05_BASE_ADDR 0xffffffffffffffff \
  CONFIG.M08_A06_BASE_ADDR 0xffffffffffffffff \
  CONFIG.M08_A07_BASE_ADDR 0xffffffffffffffff \
  CONFIG.M08_A08_BASE_ADDR 0xffffffffffffffff \
  CONFIG.M08_A09_BASE_ADDR 0xffffffffffffffff \
  CONFIG.M08_A10_BASE_ADDR 0xffffffffffffffff \
  CONFIG.M08_A11_BASE_ADDR 0xffffffffffffffff \
  CONFIG.M08_A12_BASE_ADDR 0xffffffffffffffff \
  CONFIG.M08_A13_BASE_ADDR 0xffffffffffffffff \
  CONFIG.M08_A14_BASE_ADDR 0xffffffffffffffff \
  CONFIG.M08_A15_BASE_ADDR 0xffffffffffffffff \
  CONFIG.M08_READ_ISSUING 1 \
  CONFIG.M08_WRITE_ISSUING 1 \
  CONFIG.M09_A00_ADDR_WIDTH 0 \
  CONFIG.M09_A00_BASE_ADDR 0xffffffffffffffff \
  CONFIG.M09_A01_BASE_ADDR 0xffffffffffffffff \
  CONFIG.M09_A02_BASE_ADDR 0xffffffffffffffff \
  CONFIG.M09_A03_BASE_ADDR 0xffffffffffffffff \
  CONFIG.M09_A04_BASE_ADDR 0xffffffffffffffff \
  CONFIG.M09_A05_BASE_ADDR 0xffffffffffffffff \
  CONFIG.M09_A06_BASE_ADDR 0xffffffffffffffff \
  CONFIG.M09_A07_BASE_ADDR 0xffffffffffffffff \
  CONFIG.M09_A08_BASE_ADDR 0xffffffffffffffff \
  CONFIG.M09_A09_BASE_ADDR 0xffffffffffffffff \
  CONFIG.M09_A10_BASE_ADDR 0xffffffffffffffff \
  CONFIG.M09_A11_BASE_ADDR 0xffffffffffffffff \
  CONFIG.M09_A12_BASE_ADDR 0xffffffffffffffff \
  CONFIG.M09_A13_BASE_ADDR 0xffffffffffffffff \
  CONFIG.M09_A14_BASE_ADDR 0xffffffffffffffff \
  CONFIG.M09_A15_BASE_ADDR 0xffffffffffffffff \
  CONFIG.M09_READ_ISSUING 1 \
  CONFIG.M09_WRITE_ISSUING 1 \
  CONFIG.M10_A00_ADDR_WIDTH 0 \
  CONFIG.M10_A00_BASE_ADDR 0xffffffffffffffff \
  CONFIG.M10_A01_BASE_ADDR 0xffffffffffffffff \
  CONFIG.M10_A02_BASE_ADDR 0xffffffffffffffff \
  CONFIG.M10_A03_BASE_ADDR 0xffffffffffffffff \
  CONFIG.M10_A04_BASE_ADDR 0xffffffffffffffff \
  CONFIG.M10_A05_BASE_ADDR 0xffffffffffffffff \
  CONFIG.M10_A06_BASE_ADDR 0xffffffffffffffff \
  CONFIG.M10_A07_BASE_ADDR 0xffffffffffffffff \
  CONFIG.M10_A08_BASE_ADDR 0xffffffffffffffff \
  CONFIG.M10_A09_BASE_ADDR 0xffffffffffffffff \
  CONFIG.M10_A10_BASE_ADDR 0xffffffffffffffff \
  CONFIG.M10_A11_BASE_ADDR 0xffffffffffffffff \
  CONFIG.M10_A12_BASE_ADDR 0xffffffffffffffff \
  CONFIG.M10_A13_BASE_ADDR 0xffffffffffffffff \
  CONFIG.M10_A14_BASE_ADDR 0xffffffffffffffff \
  CONFIG.M10_A15_BASE_ADDR 0xffffffffffffffff \
  CONFIG.M10_READ_ISSUING 1 \
  CONFIG.M10_WRITE_ISSUING 1 \
  CONFIG.M11_A00_ADDR_WIDTH 0 \
  CONFIG.M11_A00_BASE_ADDR 0xffffffffffffffff \
  CONFIG.M11_A01_BASE_ADDR 0xffffffffffffffff \
  CONFIG.M11_A02_BASE_ADDR 0xffffffffffffffff \
  CONFIG.M11_A03_BASE_ADDR 0xffffffffffffffff \
  CONFIG.M11_A04_BASE_ADDR 0xffffffffffffffff \
  CONFIG.M11_A05_BASE_ADDR 0xffffffffffffffff \
  CONFIG.M11_A06_BASE_ADDR 0xffffffffffffffff \
  CONFIG.M11_A07_BASE_ADDR 0xffffffffffffffff \
  CONFIG.M11_A08_BASE_ADDR 0xffffffffffffffff \
  CONFIG.M11_A09_BASE_ADDR 0xffffffffffffffff \
  CONFIG.M11_A10_BASE_ADDR 0xffffffffffffffff \
  CONFIG.M11_A11_BASE_ADDR 0xffffffffffffffff \
  CONFIG.M11_A12_BASE_ADDR 0xffffffffffffffff \
  CONFIG.M11_A13_BASE_ADDR 0xffffffffffffffff \
  CONFIG.M11_A14_BASE_ADDR 0xffffffffffffffff \
  CONFIG.M11_A15_BASE_ADDR 0xffffffffffffffff \
  CONFIG.M11_READ_ISSUING 1 \
  CONFIG.M11_WRITE_ISSUING 1 \
  CONFIG.M12_A00_ADDR_WIDTH 0 \
  CONFIG.M12_A00_BASE_ADDR 0xffffffffffffffff \
  CONFIG.M12_A01_BASE_ADDR 0xffffffffffffffff \
  CONFIG.M12_A02_BASE_ADDR 0xffffffffffffffff \
  CONFIG.M12_A03_BASE_ADDR 0xffffffffffffffff \
  CONFIG.M12_A04_BASE_ADDR 0xffffffffffffffff \
  CONFIG.M12_A05_BASE_ADDR 0xffffffffffffffff \
  CONFIG.M12_A06_BASE_ADDR 0xffffffffffffffff \
  CONFIG.M12_A07_BASE_ADDR 0xffffffffffffffff \
  CONFIG.M12_A08_BASE_ADDR 0xffffffffffffffff \
  CONFIG.M12_A09_BASE_ADDR 0xffffffffffffffff \
  CONFIG.M12_A10_BASE_ADDR 0xffffffffffffffff \
  CONFIG.M12_A11_BASE_ADDR 0xffffffffffffffff \
  CONFIG.M12_A12_BASE_ADDR 0xffffffffffffffff \
  CONFIG.M12_A13_BASE_ADDR 0xffffffffffffffff \
  CONFIG.M12_A14_BASE_ADDR 0xffffffffffffffff \
  CONFIG.M12_A15_BASE_ADDR 0xffffffffffffffff \
  CONFIG.M12_READ_ISSUING 1 \
  CONFIG.M12_WRITE_ISSUING 1 \
  CONFIG.M13_A00_ADDR_WIDTH 0 \
  CONFIG.M13_A00_BASE_ADDR 0xffffffffffffffff \
  CONFIG.M13_A01_BASE_ADDR 0xffffffffffffffff \
  CONFIG.M13_A02_BASE_ADDR 0xffffffffffffffff \
  CONFIG.M13_A03_BASE_ADDR 0xffffffffffffffff \
  CONFIG.M13_A04_BASE_ADDR 0xffffffffffffffff \
  CONFIG.M13_A05_BASE_ADDR 0xffffffffffffffff \
  CONFIG.M13_A06_BASE_ADDR 0xffffffffffffffff \
  CONFIG.M13_A07_BASE_ADDR 0xffffffffffffffff \
  CONFIG.M13_A08_BASE_ADDR 0xffffffffffffffff \
  CONFIG.M13_A09_BASE_ADDR 0xffffffffffffffff \
  CONFIG.M13_A10_BASE_ADDR 0xffffffffffffffff \
  CONFIG.M13_A11_BASE_ADDR 0xffffffffffffffff \
  CONFIG.M13_A12_BASE_ADDR 0xffffffffffffffff \
  CONFIG.M13_A13_BASE_ADDR 0xffffffffffffffff \
  CONFIG.M13_A14_BASE_ADDR 0xffffffffffffffff \
  CONFIG.M13_A15_BASE_ADDR 0xffffffffffffffff \
  CONFIG.M13_READ_ISSUING 1 \
  CONFIG.M13_WRITE_ISSUING 1 \
  CONFIG.M14_A00_ADDR_WIDTH 0 \
  CONFIG.M14_A00_BASE_ADDR 0xffffffffffffffff \
  CONFIG.M14_A01_BASE_ADDR 0xffffffffffffffff \
  CONFIG.M14_A02_BASE_ADDR 0xffffffffffffffff \
  CONFIG.M14_A03_BASE_ADDR 0xffffffffffffffff \
  CONFIG.M14_A04_BASE_ADDR 0xffffffffffffffff \
  CONFIG.M14_A05_BASE_ADDR 0xffffffffffffffff \
  CONFIG.M14_A06_BASE_ADDR 0xffffffffffffffff \
  CONFIG.M14_A07_BASE_ADDR 0xffffffffffffffff \
  CONFIG.M14_A08_BASE_ADDR 0xffffffffffffffff \
  CONFIG.M14_A09_BASE_ADDR 0xffffffffffffffff \
  CONFIG.M14_A10_BASE_ADDR 0xffffffffffffffff \
  CONFIG.M14_A11_BASE_ADDR 0xffffffffffffffff \
  CONFIG.M14_A12_BASE_ADDR 0xffffffffffffffff \
  CONFIG.M14_A13_BASE_ADDR 0xffffffffffffffff \
  CONFIG.M14_A14_BASE_ADDR 0xffffffffffffffff \
  CONFIG.M14_A15_BASE_ADDR 0xffffffffffffffff \
  CONFIG.M14_READ_ISSUING 1 \
  CONFIG.M14_WRITE_ISSUING 1 \
  CONFIG.M15_A00_ADDR_WIDTH 0 \
  CONFIG.M15_A00_BASE_ADDR 0xffffffffffffffff \
  CONFIG.M15_A01_BASE_ADDR 0xffffffffffffffff \
  CONFIG.M15_A02_BASE_ADDR 0xffffffffffffffff \
  CONFIG.M15_A03_BASE_ADDR 0xffffffffffffffff \
  CONFIG.M15_A04_BASE_ADDR 0xffffffffffffffff \
  CONFIG.M15_A05_BASE_ADDR 0xffffffffffffffff \
  CONFIG.M15_A06_BASE_ADDR 0xffffffffffffffff \
  CONFIG.M15_A07_BASE_ADDR 0xffffffffffffffff \
  CONFIG.M15_A08_BASE_ADDR 0xffffffffffffffff \
  CONFIG.M15_A09_BASE_ADDR 0xffffffffffffffff \
  CONFIG.M15_A10_BASE_ADDR 0xffffffffffffffff \
  CONFIG.M15_A11_BASE_ADDR 0xffffffffffffffff \
  CONFIG.M15_A12_BASE_ADDR 0xffffffffffffffff \
  CONFIG.M15_A13_BASE_ADDR 0xffffffffffffffff \
  CONFIG.M15_A14_BASE_ADDR 0xffffffffffffffff \
  CONFIG.M15_A15_BASE_ADDR 0xffffffffffffffff \
  CONFIG.M15_READ_ISSUING 1 \
  CONFIG.M15_WRITE_ISSUING 1 \
  CONFIG.NUM_MI 2 \
  CONFIG.S01_READ_ACCEPTANCE 1 \
  CONFIG.S01_WRITE_ACCEPTANCE 1 \
  CONFIG.S02_READ_ACCEPTANCE 1 \
  CONFIG.S02_WRITE_ACCEPTANCE 1 \
  CONFIG.S03_READ_ACCEPTANCE 1 \
  CONFIG.S03_WRITE_ACCEPTANCE 1 \
  CONFIG.S04_READ_ACCEPTANCE 1 \
  CONFIG.S04_WRITE_ACCEPTANCE 1 \
  CONFIG.S05_READ_ACCEPTANCE 1 \
  CONFIG.S05_WRITE_ACCEPTANCE 1 \
  CONFIG.S06_READ_ACCEPTANCE 1 \
  CONFIG.S06_WRITE_ACCEPTANCE 1 \
  CONFIG.S07_READ_ACCEPTANCE 1 \
  CONFIG.S07_WRITE_ACCEPTANCE 1 \
  CONFIG.S08_READ_ACCEPTANCE 1 \
  CONFIG.S08_WRITE_ACCEPTANCE 1 \
  CONFIG.S09_READ_ACCEPTANCE 1 \
  CONFIG.S09_WRITE_ACCEPTANCE 1 \
  CONFIG.S10_READ_ACCEPTANCE 1 \
  CONFIG.S10_WRITE_ACCEPTANCE 1 \
  CONFIG.S11_READ_ACCEPTANCE 1 \
  CONFIG.S11_WRITE_ACCEPTANCE 1 \
  CONFIG.S12_READ_ACCEPTANCE 1 \
  CONFIG.S12_WRITE_ACCEPTANCE 1 \
  CONFIG.S13_READ_ACCEPTANCE 1 \
  CONFIG.S13_WRITE_ACCEPTANCE 1 \
  CONFIG.S14_READ_ACCEPTANCE 1 \
  CONFIG.S14_WRITE_ACCEPTANCE 1 \
  CONFIG.S15_READ_ACCEPTANCE 1 \
  CONFIG.S15_WRITE_ACCEPTANCE 1 \
  CONFIG.STRATEGY 1 \
] [get_bd_cells axi_crossbar_0]
create_bd_cell -type ip -vlnv xilinx.com:ip:axi_fifo_mm_s:4.2 axi_fifo_mm_s_0
set_property -dict {CONFIG.C_USE_RX_DATA 0 CONFIG.C_USE_TX_CTRL 0} [get_bd_cells axi_fifo_mm_s_0]
create_bd_cell -type ip -vlnv xilinx.com:ip:axi_gpio:2.0 axi_gpio_0
set_property -dict [list \
  CONFIG.C_ALL_INPUTS_2 1 \
  CONFIG.C_ALL_OUTPUTS 1 \
  CONFIG.C_GPIO_WIDTH 32 \
  CONFIG.C_IS_DUAL 1 \
] [get_bd_cells axi_gpio_0]

# ---- hierarchy /PCIe ----
current_bd_instance /PCIe
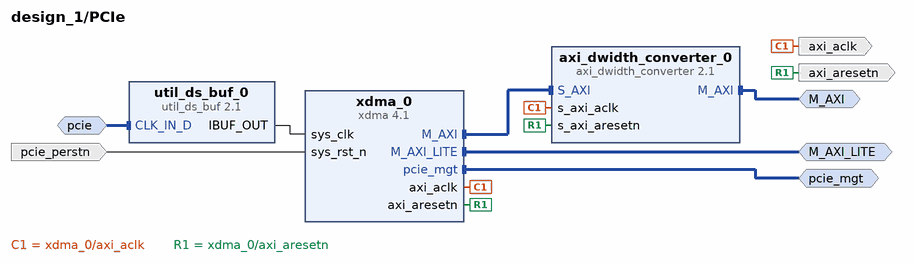
[diagram p4: block diagram inside /PCIe]
create_bd_intf_pin -mode Slave -vlnv xilinx.com:interface:diff_clock_rtl:1.0 pcie
create_bd_intf_pin -mode Master -vlnv xilinx.com:interface:aximm_rtl:1.0 M_AXI
create_bd_intf_pin -mode Master -vlnv xilinx.com:interface:aximm_rtl:1.0 M_AXI_LITE
create_bd_intf_pin -mode Master -vlnv xilinx.com:interface:pcie_7x_mgt_rtl:1.0 pcie_mgt
create_bd_pin -dir O -type clk axi_aclk
create_bd_pin -dir O -type rst axi_aresetn
create_bd_pin -dir I -type rst pcie_perstn

create_bd_cell -type ip -vlnv xilinx.com:ip:axi_dwidth_converter:2.1 axi_dwidth_converter_0
set_property -dict [list \
  CONFIG.ADDR_WIDTH 32 \
  CONFIG.FIFO_MODE 0 \
  CONFIG.PROTOCOL AXI4 \
  CONFIG.READ_WRITE_MODE READ_ONLY \
] [get_bd_cells axi_dwidth_converter_0]
create_bd_cell -type ip -vlnv xilinx.com:ip:util_ds_buf:2.1 util_ds_buf_0
set_property -dict {CONFIG.C_BUF_TYPE IBUFDSGTE} [get_bd_cells util_ds_buf_0]
create_bd_cell -type ip -vlnv xilinx.com:ip:xdma:4.1 xdma_0
set_property -dict [list \
  CONFIG.PF0_DEVICE_ID_mqdma 9024 \
  CONFIG.PF2_DEVICE_ID_mqdma 9024 \
  CONFIG.PF3_DEVICE_ID_mqdma 9024 \
  CONFIG.Shared_Logic_Both_7xG2 false \
  CONFIG.axi_data_width 128_bit \
  CONFIG.axi_id_width 2 \
  CONFIG.axil_master_64bit_en false \
  CONFIG.axilite_master_en true \
  CONFIG.axilite_master_scale Megabytes \
  CONFIG.axilite_master_size 1 \
  CONFIG.axisten_freq 125 \
  CONFIG.cfg_mgmt_if false \
  CONFIG.dsc_bypass_rd 0001 \
  CONFIG.dsc_bypass_wr 0000 \
  CONFIG.mode_selection Advanced \
  CONFIG.pcie_extended_tag false \
  CONFIG.pciebar2axibar_axil_master 0x40000000 \
  CONFIG.performance true \
  CONFIG.pf0_device_id 7024 \
  CONFIG.pf0_msi_enabled true \
  CONFIG.pl_link_cap_max_link_speed 5.0_GT/s \
  CONFIG.pl_link_cap_max_link_width X4 \
  CONFIG.plltype QPLL1 \
  CONFIG.xdma_pcie_64bit_en true \
  CONFIG.xdma_pcie_prefetchable true \
  CONFIG.xdma_rnum_rids 2 \
  CONFIG.xdma_wnum_rids 8 \
] [get_bd_cells xdma_0]

# ---- connections ----

current_bd_instance /Memory
connect_bd_intf_net [get_bd_intf_pins S00_AXI] [get_bd_intf_pins axi_crossbar_0/S00_AXI]
connect_bd_intf_net [get_bd_intf_pins DDR3] [get_bd_intf_pins mig_7series_0/DDR3]
connect_bd_intf_net [get_bd_intf_pins S01_AXI] [get_bd_intf_pins axi_crossbar_0/S01_AXI]
connect_bd_intf_net [get_bd_intf_pins axi_crossbar_0/M00_AXI] [get_bd_intf_pins axi_clock_converter_0/S_AXI]
connect_bd_intf_net [get_bd_intf_pins axi_clock_converter_0/M_AXI] [get_bd_intf_pins mig_7series_0/S_AXI]
connect_bd_net [get_bd_pins xlconstant_1/dout] [get_bd_pins mig_7series_0/sys_rst] [get_bd_pins mig_7series_0/aresetn]
connect_bd_net [get_bd_pins mig_7series_0/ui_clk_sync_rst] [get_bd_pins util_vector_logic_0/Op1]
connect_bd_net [get_bd_pins clk_wiz_0/clk_out1] [get_bd_pins mig_7series_0/sys_clk_i]
connect_bd_net [get_bd_pins xlconstant_0/dout] [get_bd_pins clk_wiz_0/resetn]
connect_bd_net -net xdma_0_axi_aclk [get_bd_pins ACLK] \
  [get_bd_pins axi_clock_converter_0/s_axi_aclk] [get_bd_pins axi_crossbar_0/aclk] [get_bd_pins clk_wiz_0/clk_in1]
connect_bd_net [get_bd_pins S00_ARESETN] [get_bd_pins axi_clock_converter_0/s_axi_aresetn] [get_bd_pins axi_crossbar_0/aresetn]
connect_bd_net [get_bd_pins util_vector_logic_0/Res] [get_bd_pins axi_clock_converter_0/m_axi_aresetn]
connect_bd_net [get_bd_pins mig_7series_0/ui_clk] [get_bd_pins axi_clock_converter_0/m_axi_aclk]

current_bd_instance /Datamover
connect_bd_intf_net [get_bd_intf_pins S_AXIS_S2MM_CMD] [get_bd_intf_pins axi_datamover_0/S_AXIS_S2MM_CMD]
connect_bd_intf_net [get_bd_intf_pins M_AXI_S2MM] [get_bd_intf_pins axi_datamover_0/M_AXI_S2MM]
connect_bd_intf_net [get_bd_intf_pins S_AXIS_S2MM] [get_bd_intf_pins axi_datamover_0/S_AXIS_S2MM]
connect_bd_net [get_bd_pins xlconstant_0/dout] [get_bd_pins axi_datamover_0/s2mm_allow_addr_req]
connect_bd_net [get_bd_pins axi_datamover_0/s2mm_err] [get_bd_pins s2mm_err]
connect_bd_net [get_bd_pins axi_datamover_0/s2mm_wr_xfer_cmplt] [get_bd_pins s2mm_wr_xfer_cmplt]
connect_bd_net -net s2mm_halt_0_1 [get_bd_pins s2mm_halt] [get_bd_pins axi_datamover_0/s2mm_halt]
connect_bd_net [get_bd_pins axi_aclk] [get_bd_pins axi_datamover_0/m_axi_s2mm_aclk] [get_bd_pins axi_datamover_0/m_axis_s2mm_cmdsts_awclk]
connect_bd_net [get_bd_pins axi_aresetn] [get_bd_pins axi_datamover_0/m_axi_s2mm_aresetn] [get_bd_pins axi_datamover_0/m_axis_s2mm_cmdsts_aresetn]

current_bd_instance /AXI_LITE_IO
connect_bd_intf_net [get_bd_intf_pins S00_AXI] [get_bd_intf_pins axi_crossbar_0/S00_AXI]
connect_bd_intf_net [get_bd_intf_pins axi_crossbar_0/M00_AXI] [get_bd_intf_pins axi_fifo_mm_s_0/S_AXI]
connect_bd_intf_net [get_bd_intf_pins axi_crossbar_0/M01_AXI] [get_bd_intf_pins axi_gpio_0/S_AXI]
connect_bd_intf_net [get_bd_intf_pins AXI_STR_TXD_0] [get_bd_intf_pins axi_fifo_mm_s_0/AXI_STR_TXD]
connect_bd_net [get_bd_pins gpio2_io_i] [get_bd_pins axi_gpio_0/gpio2_io_i]
connect_bd_net [get_bd_pins axi_aclk] [get_bd_pins axi_crossbar_0/aclk] [get_bd_pins axi_fifo_mm_s_0/s_axi_aclk] [get_bd_pins axi_gpio_0/s_axi_aclk]
connect_bd_net [get_bd_pins axi_resetn] \
  [get_bd_pins axi_crossbar_0/aresetn] [get_bd_pins axi_fifo_mm_s_0/s_axi_aresetn] [get_bd_pins axi_gpio_0/s_axi_aresetn]
connect_bd_net [get_bd_pins axi_gpio_0/gpio_io_o] [get_bd_pins gpio_io_o_0]

current_bd_instance /PCIe
connect_bd_intf_net [get_bd_intf_pins xdma_0/M_AXI] [get_bd_intf_pins axi_dwidth_converter_0/S_AXI]
connect_bd_intf_net -intf_net PCIe_M_AXI_LITE [get_bd_intf_pins M_AXI_LITE] [get_bd_intf_pins xdma_0/M_AXI_LITE]
connect_bd_intf_net -intf_net xdma_0_M_AXI [get_bd_intf_pins M_AXI] [get_bd_intf_pins axi_dwidth_converter_0/M_AXI]
connect_bd_intf_net -intf_net CLK_IN_D_0_1 [get_bd_intf_pins pcie] [get_bd_intf_pins util_ds_buf_0/CLK_IN_D]
connect_bd_intf_net [get_bd_intf_pins pcie_mgt] [get_bd_intf_pins xdma_0/pcie_mgt]
connect_bd_net [get_bd_pins util_ds_buf_0/IBUF_OUT] [get_bd_pins xdma_0/sys_clk]
connect_bd_net [get_bd_pins xdma_0/axi_aclk] [get_bd_pins axi_aclk] [get_bd_pins axi_dwidth_converter_0/s_axi_aclk]
connect_bd_net -net PCIe_axi_aresetn [get_bd_pins xdma_0/axi_aresetn] [get_bd_pins axi_aresetn] [get_bd_pins axi_dwidth_converter_0/s_axi_aresetn]
connect_bd_net -net sys_rst_n_0_1 [get_bd_pins pcie_perstn] [get_bd_pins xdma_0/sys_rst_n]

current_bd_instance /
connect_bd_intf_net [get_bd_intf_pins Datamover/M_AXI_S2MM] [get_bd_intf_pins Memory/S01_AXI]
connect_bd_intf_net -intf_net CLK_IN_D_0_1 [get_bd_intf_ports pcie] [get_bd_intf_pins PCIe/pcie]
connect_bd_intf_net -intf_net xdma_0_M_AXI [get_bd_intf_pins PCIe/M_AXI] [get_bd_intf_pins Memory/S00_AXI]
connect_bd_intf_net -intf_net mig_7series_0_DDR3 [get_bd_intf_ports DDR3] [get_bd_intf_pins Memory/DDR3]
connect_bd_intf_net [get_bd_intf_ports AXI_STR_TXD_0] [get_bd_intf_pins AXI_LITE_IO/AXI_STR_TXD_0]
connect_bd_intf_net [get_bd_intf_pins PCIe/M_AXI_LITE] [get_bd_intf_pins AXI_LITE_IO/S00_AXI]
connect_bd_intf_net -intf_net xdma_0_pcie_mgt [get_bd_intf_ports pcie_mgt] [get_bd_intf_pins PCIe/pcie_mgt]
connect_bd_intf_net -intf_net S_AXIS_S2MM_0_1 [get_bd_intf_ports S_AXIS_S2MM] [get_bd_intf_pins Datamover/S_AXIS_S2MM]
connect_bd_intf_net -intf_net S_AXIS_S2MM_CMD_0_1 [get_bd_intf_ports S_AXIS_S2MM_CMD] [get_bd_intf_pins Datamover/S_AXIS_S2MM_CMD]
connect_bd_net -net sys_rst_n_0_1 [get_bd_ports pcie_perstn] [get_bd_pins PCIe/pcie_perstn]
connect_bd_net -net xdma_0_axi_aclk [get_bd_pins PCIe/axi_aclk] \
  [get_bd_pins Memory/ACLK] [get_bd_pins Datamover/axi_aclk] [get_bd_ports axi_aclk] [get_bd_pins AXI_LITE_IO/axi_aclk]
connect_bd_net [get_bd_pins Datamover/s2mm_err] [get_bd_ports s2mm_err]
connect_bd_net [get_bd_pins Datamover/s2mm_wr_xfer_cmplt] [get_bd_ports s2mm_wr_xfer_cmplt]
connect_bd_net -net gpio2_io_i_0_1 [get_bd_ports gpio2_io_i] [get_bd_pins AXI_LITE_IO/gpio2_io_i]
connect_bd_net [get_bd_pins PCIe/axi_aresetn] [get_bd_pins Memory/S00_ARESETN] [get_bd_ports axi_aresetn] [get_bd_pins AXI_LITE_IO/axi_resetn]
connect_bd_net -net S01_ARESETN_0_1 [get_bd_ports S01_ARESETN] [get_bd_pins Datamover/axi_aresetn]
connect_bd_net -net s2mm_halt_0_1 [get_bd_ports s2mm_halt] [get_bd_pins Datamover/s2mm_halt]
connect_bd_net [get_bd_pins AXI_LITE_IO/gpio_io_o_0] [get_bd_ports gpio_io_o_0]

# ---- address map ----
assign_bd_address -offset 0x00000000 -range 512M -target_address_space [get_bd_addr_spaces Datamover/axi_datamover_0/Data_S2MM] [get_bd_addr_segs Memory/mig_7series_0/memmap/memaddr]
assign_bd_address -offset 0x0000000000000000 -range 512M -target_address_space [get_bd_addr_spaces PCIe/xdma_0/M_AXI] [get_bd_addr_segs Memory/mig_7series_0/memmap/memaddr]
assign_bd_address -offset 0x40000000 -range 64K -target_address_space [get_bd_addr_spaces PCIe/xdma_0/M_AXI_LITE] [get_bd_addr_segs AXI_LITE_IO/axi_gpio_0/S_AXI/Reg]
assign_bd_address -offset 0x40020000 -range 64K -target_address_space [get_bd_addr_spaces PCIe/xdma_0/M_AXI_LITE] [get_bd_addr_segs AXI_LITE_IO/axi_fifo_mm_s_0/S_AXI/Mem0]

validate_bd_design
save_bd_design
